# EAGLE schematic semi-controlled-rectifier-breakout-board (EAGLE 9.6.2)
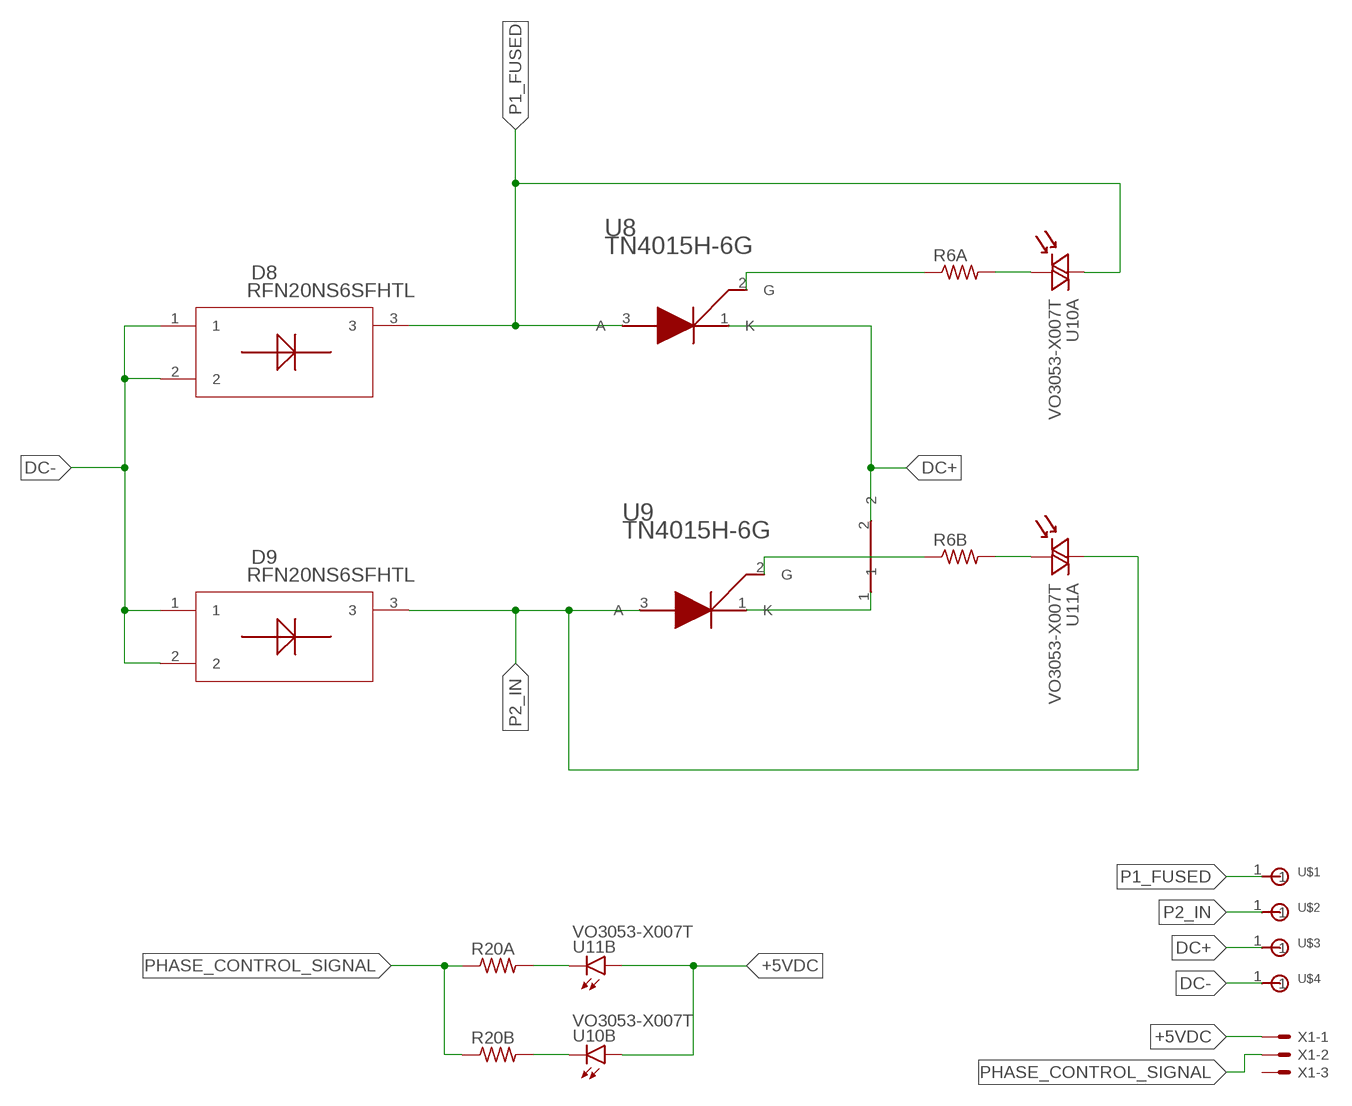
[diagram p0: schematic, sheet 1]

## Parts
D8  RFN20NS6SFHTL  RFN20NS6SFHTLDIO_RFN10N_ROM-M  [DIO_RFN10N_ROM-M]
D9  RFN20NS6SFHTL  RFN20NS6SFHTLDIO_RFN10N_ROM-M  [DIO_RFN10N_ROM-M]
R6A  R-US_0207/7  [0207/7]
R6B  R-US_0207/7  [0207/7]
R20A  R-US_0207/7  [0207/7]
R20B  R-US_0207/7  [0207/7]
U8  TN4015H-6G  [DIO_RFN10N_ROM-M]
U9  TN4015H-6G  [DIO_RFN10N_ROM-M]
U10  VO3053-X007T  [SOIC254P1030X460-6N]
U11  VO3053-X007T  [SOIC254P1030X460-6N]
U$1  90MIL_TERMINAL  [90MIL_TERMINAL]
U$2  90MIL_TERMINAL  [90MIL_TERMINAL]
U$3  90MIL_TERMINAL  [90MIL_TERMINAL]
U$4  90MIL_TERMINAL  [90MIL_TERMINAL]
U$5  1000MIL_JUMPER  [1000MIL_JUMPER]
X1  22-23-2031  [22-23-2031]

## Nets
+5VDC: U10.1(B:A) U11.1(B:A) X1.1
DC+: U8.1(K) U$3.1 U$5.2
DC-: D8.1 D8.2 D9.1 D9.2 U$4.1
N$1: U9.1(K) U$5.1
N$2: R6A.2 U10.4(A:A1)
N$4: R6B.2 U11.4(A:A1)
N$5: R6A.1 U8.2(G)
N$6: R6B.1 U9.2(G)
N$7: R20A.2 U11.2(B:C)
N$8: R20B.2 U10.2(B:C)
P1_FUSED: D8.3 U8.3(A) U10.6(A:A2) U$1.1
P2_IN: D9.3 U9.3(A) U11.6(A:A2) U$2.1
PHASE_CONTROL_SIGNAL: R20A.1 R20B.1 X1.2
Unconnected: X1.3

## Library data of the parts
D8 D9 = RectifierParts:RFN20NS6SFHTL; COPYRIGHT: Copyright (C) 2022 Ultra Librarian. All rights reserved.; DIGI-KEY_PART_NUMBER_1: RFN20NS6SFHTLCT-ND; DIGI-KEY_PART_NUMBER_2: RFN20NS6SFHTLDKR-ND; DIGI-KEY_PART_NUMBER_3: RFN20NS6SFHTLTR-ND; MANUFACTURER_PART_NUMBER: RFN20NS6SFHTL; MFR_NAME: ROHM Semiconductor
R6A R6B R20A R20B = rcl:R-US_: RESISTOR, American symbol; SPICEPREFIX: R
U8 U9 = RectifierParts:TN4015H-6G
U10 U11 = RectifierParts:VO3053-X007T
U$1-U$4 = RectifierParts:90MIL_TERMINAL
U$5 = RectifierParts:1000MIL_JUMPER
X1 = con-molex:22-23-2031: .100" (2.54mm) Center Header - 3 Pin; MF: MOLEX; MPN: 22-23-2031; OC_FARNELL: 1462950; OC_NEWARK: 30C0862